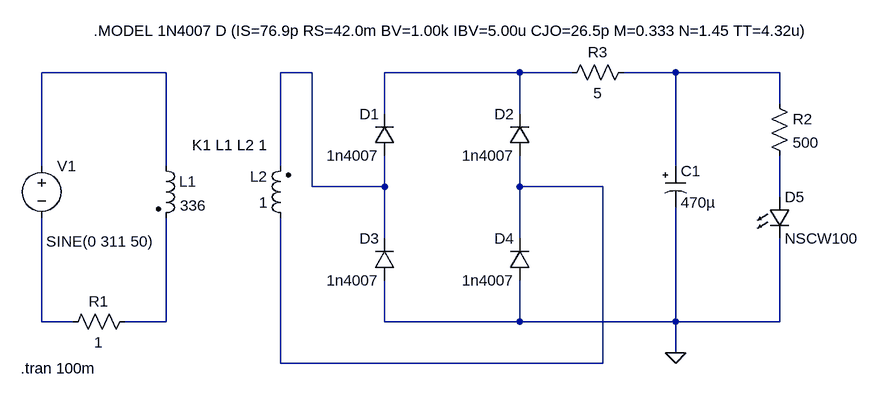
[diagram p0: schematic AC-to-DC-converter.asc]
AC-to-DC-converter.asc, the LTspice schematic file:
Version 4
SHEET 1 880 680
WIRE -256 32 -448 32
WIRE -32 32 -80 32
WIRE 288 32 80 32
WIRE 368 32 288 32
WIRE 528 32 448 32
WIRE 688 32 528 32
WIRE 688 80 688 32
WIRE 80 96 80 32
WIRE 288 96 288 32
WIRE -448 176 -448 32
WIRE -256 176 -256 32
WIRE -80 176 -80 32
WIRE 528 176 528 32
WIRE -32 208 -32 32
WIRE 80 208 80 160
WIRE 80 208 -32 208
WIRE 288 208 288 160
WIRE 416 208 288 208
WIRE 688 224 688 160
WIRE 80 288 80 208
WIRE 288 288 288 208
WIRE -448 416 -448 256
WIRE -400 416 -448 416
WIRE -256 416 -256 256
WIRE -256 416 -320 416
WIRE 80 416 80 352
WIRE 288 416 288 352
WIRE 288 416 80 416
WIRE 528 416 528 240
WIRE 528 416 288 416
WIRE 688 416 688 288
WIRE 688 416 528 416
WIRE 528 464 528 416
WIRE -80 480 -80 256
WIRE 416 480 416 208
WIRE 416 480 -80 480
FLAG 528 464 0
SYMBOL diode 96 160 R180
WINDOW 0 24 64 Left 2
WINDOW 3 24 0 Left 2
SYMATTR InstName D1
SYMATTR Value 1n4007
SYMBOL diode 304 160 R180
WINDOW 0 24 64 Left 2
WINDOW 3 24 0 Left 2
SYMATTR InstName D2
SYMATTR Value 1n4007
SYMBOL diode 96 352 R180
WINDOW 0 24 64 Left 2
WINDOW 3 24 0 Left 2
SYMATTR InstName D3
SYMATTR Value 1n4007
SYMBOL diode 304 352 R180
WINDOW 0 24 64 Left 2
WINDOW 3 24 0 Left 2
SYMATTR InstName D4
SYMATTR Value 1n4007
SYMBOL voltage -448 160 R0
WINDOW 3 7 132 Left 2
WINDOW 123 0 0 Left 0
WINDOW 39 0 0 Left 0
SYMATTR Value SINE(0 311 50)
SYMATTR InstName V1
SYMBOL ind2 -272 160 R0
WINDOW 3 37 77 Left 2
SYMATTR Value 336
SYMATTR InstName L1
SYMATTR Type ind
SYMBOL ind2 -64 272 R180
WINDOW 0 36 80 Left 2
WINDOW 3 36 40 Left 2
SYMATTR InstName L2
SYMATTR Value 1
SYMATTR Type ind
SYMBOL res -304 400 R90
WINDOW 0 0 56 VBottom 2
WINDOW 3 32 56 VTop 2
SYMATTR InstName R1
SYMATTR Value 1
SYMBOL polcap 512 176 R0
WINDOW 3 24 56 Left 2
SYMATTR Value 470µ
SYMATTR InstName C1
SYMATTR Description Capacitor
SYMATTR Type cap
SYMATTR SpiceLine V=6.3 Irms=500m Rser=0.114 Lser=6.33637n mfg="Würth Elektronik" pn="865060153008 WCAP-ASLL 8x10,5" type="Al electrolytic"
SYMBOL res 672 64 R0
SYMATTR InstName R2
SYMATTR Value 500
SYMBOL LED 672 224 R0
SYMATTR InstName D5
SYMATTR Value NSCW100
SYMBOL res 464 16 R90
WINDOW 0 0 56 VBottom 2
WINDOW 3 32 56 VTop 2
SYMATTR InstName R3
SYMATTR Value 5
TEXT -216 144 Left 2 !K1 L1 L2 1
TEXT -480 488 Left 2 !.tran 100m
TEXT -368 -32 Left 2 !.MODEL 1N4007 D (IS=76.9p RS=42.0m BV=1.00k IBV=5.00u CJO=26.5p M=0.333 N=1.45 TT=4.32u)

The netlist it stands for:
* AC-to-DC-converter.asc
D1 N002 N003 1n4007
D2 N005 N003 1n4007
D3 0 N002 1n4007
D4 0 N005 1n4007
V1 N001 N007 SINE(0 311 50)
L1 N001 N008 336
L2 N005 N002 1
R1 N008 N007 1
C1 N004 0 470µ V=6.3 Irms=500m Rser=0.114 Lser=6.33637n mfg="Würth Elektronik" pn="865060153008 WCAP-ASLL 8x10,5" type="Al electrolytic"
R2 N004 N006 500
D5 N006 0 NSCW100
R3 N004 N003 5
.model D D
.lib standard.dio
K1 L1 L2 1
.tran 100m
.MODEL 1N4007 D (IS=76.9p RS=42.0m BV=1.00k IBV=5.00u CJO=26.5p M=0.333 N=1.45 TT=4.32u)
.backanno
.end